# EAGLE design TremorMug_Final (EAGLE 9.6.2)
AUTHOR: LEWIS, YEE; BOARD_NAME: NUCLEO L476RG; DOC_NUM: 1; PROJECT_NAME: TREMOR MUG 1; REVISION: A
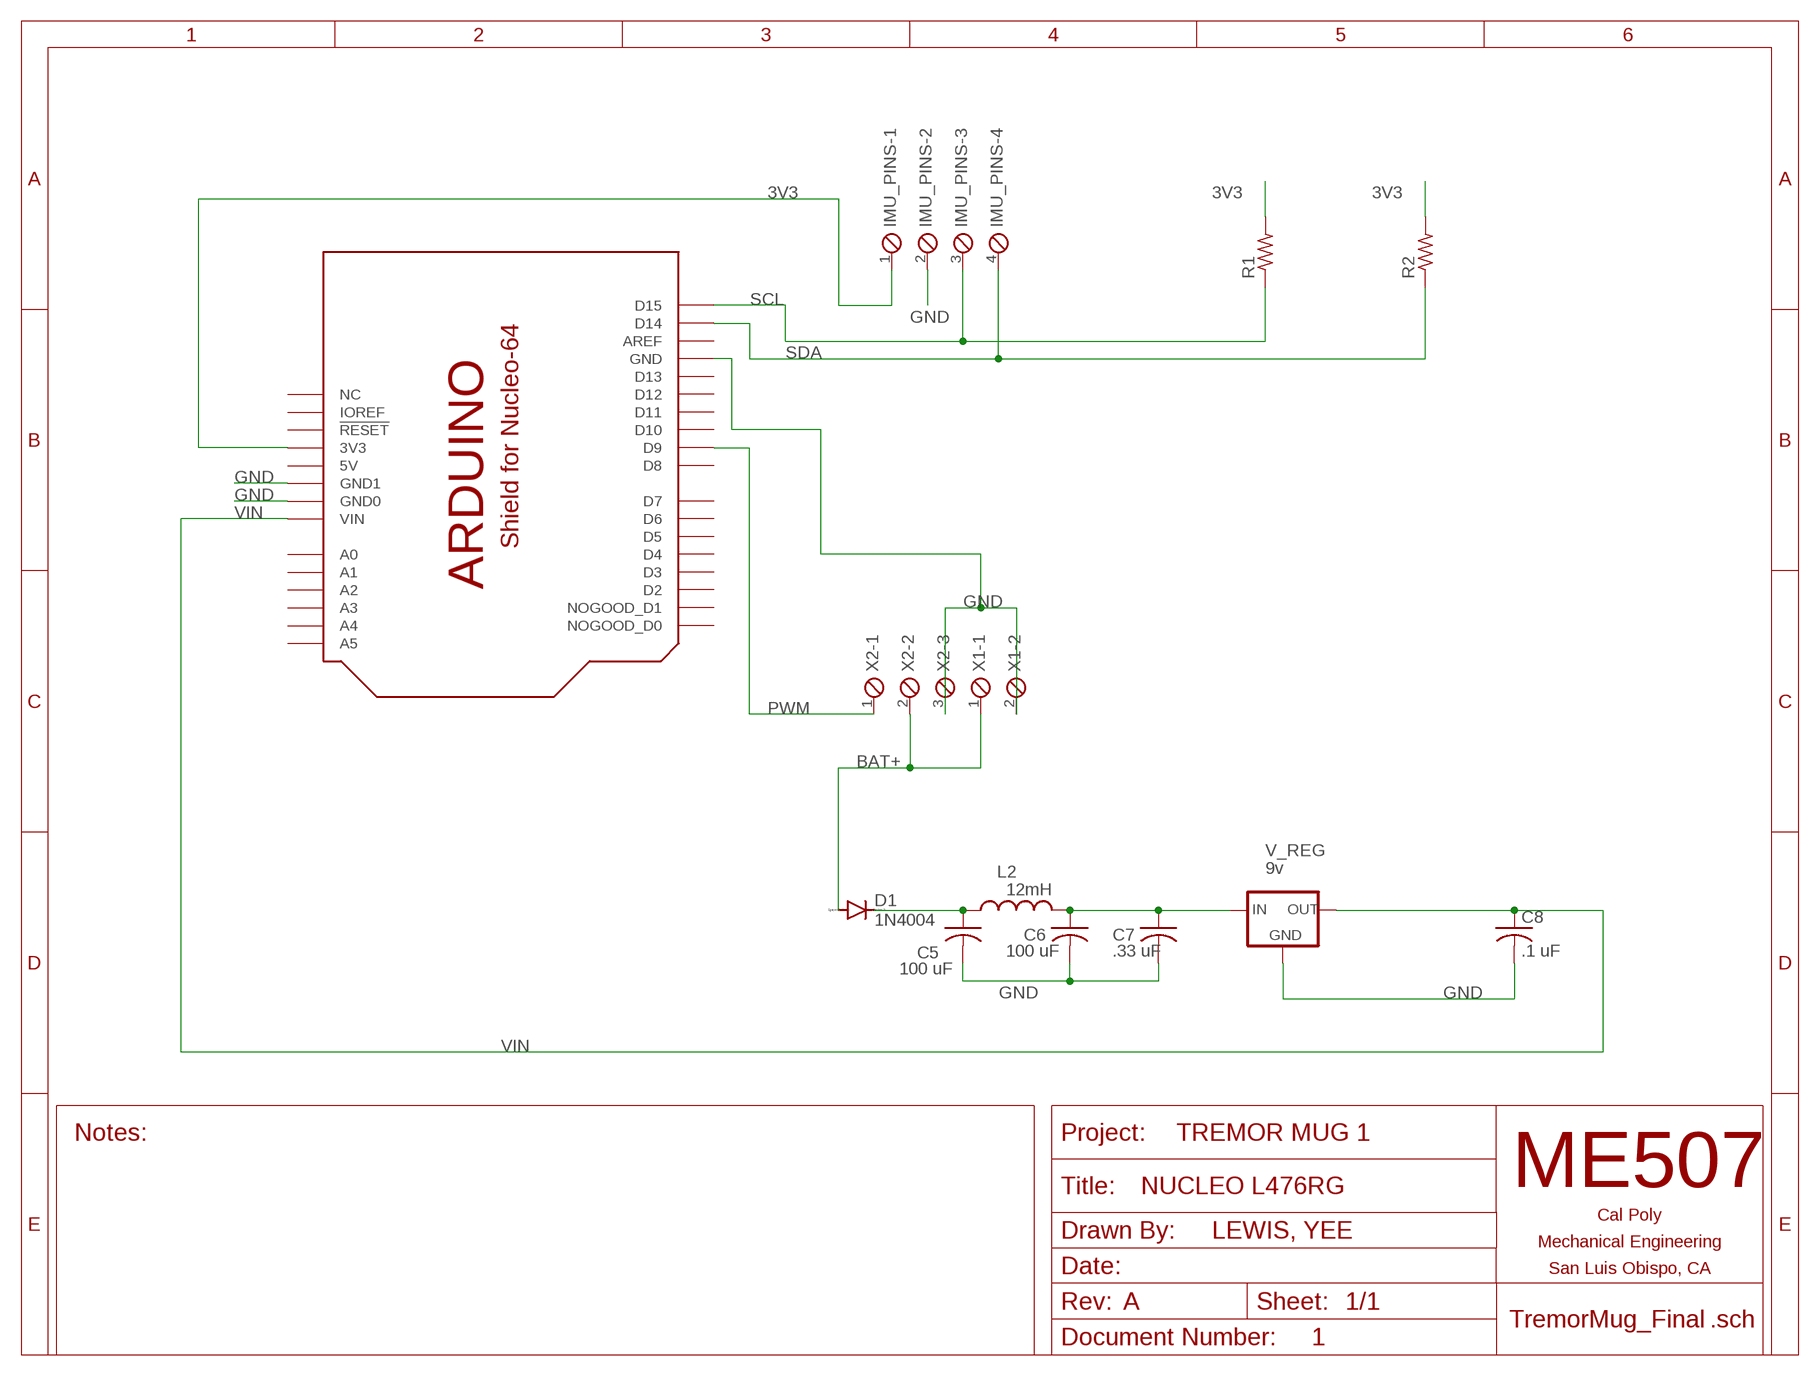
[diagram p0: schematic, sheet 1]

## Parts
C5  100 uF  C-US050-045X075  [C050-045X075]
C6  100 uF  C-US050-045X075  [C050-045X075]
C7  .33 uF  C-USC0805  [C0805]
C8  .1 uF  C-USC0805  [C0805]
D1  1N4004  [DO41-10]
IMU_PINS  SCREWTERM_4P_254  [4POL254]
L2  12mH  L-US0207/5V  [0207/5V]
R1  R-US_0204/7  [0204/7]
R2  R-US_0204/7  [0204/7]
U$1  SHIELD_FOR_NUCLE0_64_STANDARD  [SHIELD_FOR_NUCLEO_64_STD]
V_REG  9v  78MXXL  [78MXXL]
X1  SCREWTERM_2P_508  [2POL508]
X2  SCREWTERM_3P_381  [3POL381]

## Nets
3V3: IMU_PINS.1 R1.2 R2.2 U$1.3V(3V3)
BAT+: D1.A X1.1 X2.2
GND: C5.2 C6.2 C7.2 C8.2 IMU_PINS.2 U$1.GND U$1.GND1(GND0) U$1.GND2(GND1) V_REG.GND X1.2 X2.3
N$1: C6.1 C7.1 L2.2 V_REG.IN
N$3: C5.1 D1.C L2.1
PWM: U$1.D9 X2.1
SCL: IMU_PINS.3 R1.1 U$1.D15
SDA: IMU_PINS.4 R2.1 U$1.D14
VIN: C8.1 U$1.VIN V_REG.OUT
Unconnected: U$1.A0 U$1.A1 U$1.A2 U$1.A3 U$1.A4 U$1.A5 U$1.AREF U$1.D0(NOGOOD_D0) U$1.D1(NOGOOD_D1) U$1.D2 U$1.D3 U$1.D4 U$1.D5 U$1.D6 U$1.D7 U$1.D8 U$1.D10 U$1.D11 U$1.D12 U$1.D13 U$1.IOREF U$1.NC U$1.NRST(!RESET)

## Power pins joined to a net without a drawn wire
5V: U$1.5V

## Library data of the parts
C5-C8 = rcl:C-US: CAPACITOR, American symbol; SPICEPREFIX: C
D1 = diode:1N4004: DIODE general purpose rectifier, 1 A
IMU_PINS = ME507:SCREWTERM_4P: Screw Terminal Block This part is designed for a screw terminal connector. The 2.54mm (0.100 inch) foorprint can also be used for male or female pin headers such as those on most development boards. One can also solder wires directly into the holes, though this makes modifications or repairs to the system more inconvenient. Larger versions can carry more current.
L2 = rcl:L-US: INDUCTOR, American symbol; SPICEPREFIX: L
R1 R2 = rcl:R-US_: RESISTOR, American symbol; SPICEPREFIX: R
U$1 = ME507:SHIELD_FOR_NUCLE0_64: Arduino Style Shield for Nucleo-64 This is a board outline with pin locations for an Arduino style shield which fits on top of an STM32 Nucleo-64. Pin names are generic except for Nucleo specific pins such as IOREF. There are two board sizes, the standard which matches the size of an Arduino Uno, and the short version which can be less expensive to produce if you don't need a lot of board area. The outline is on the DIMENSION layer. When making a new board, you must delete the lines which form the default board outline so that this package's outlines control the dimensions of the board. Pins D0 and D1 are connected to a communications port and are not available for general use, so they are labeled as NOGOOD on the symbol and footprints.
V_REG = v-reg:78MXXL: VOLTAGE REGULATOR
X1 = ME507:SCREWTERM_2P: Screw Terminal Block This part is designed for a screw terminal connector. The 2.54mm (0.100 inch) foorprint can also be used for male or female pin headers such as those on most development boards. One can also solder wires directly into the holes, though this makes modifications or repairs to the system more inconvenient. Larger versions can carry more current.
X2 = ME507:SCREWTERM_3P: Screw Terminal Block This part is designed for a screw terminal connector. The 2.54mm (0.100 inch) foorprint can also be used for male or female pin headers such as those on most development boards. One can also solder wires directly into the holes, though this makes modifications or repairs to the system more inconvenient. Larger versions can carry more current.

## Board
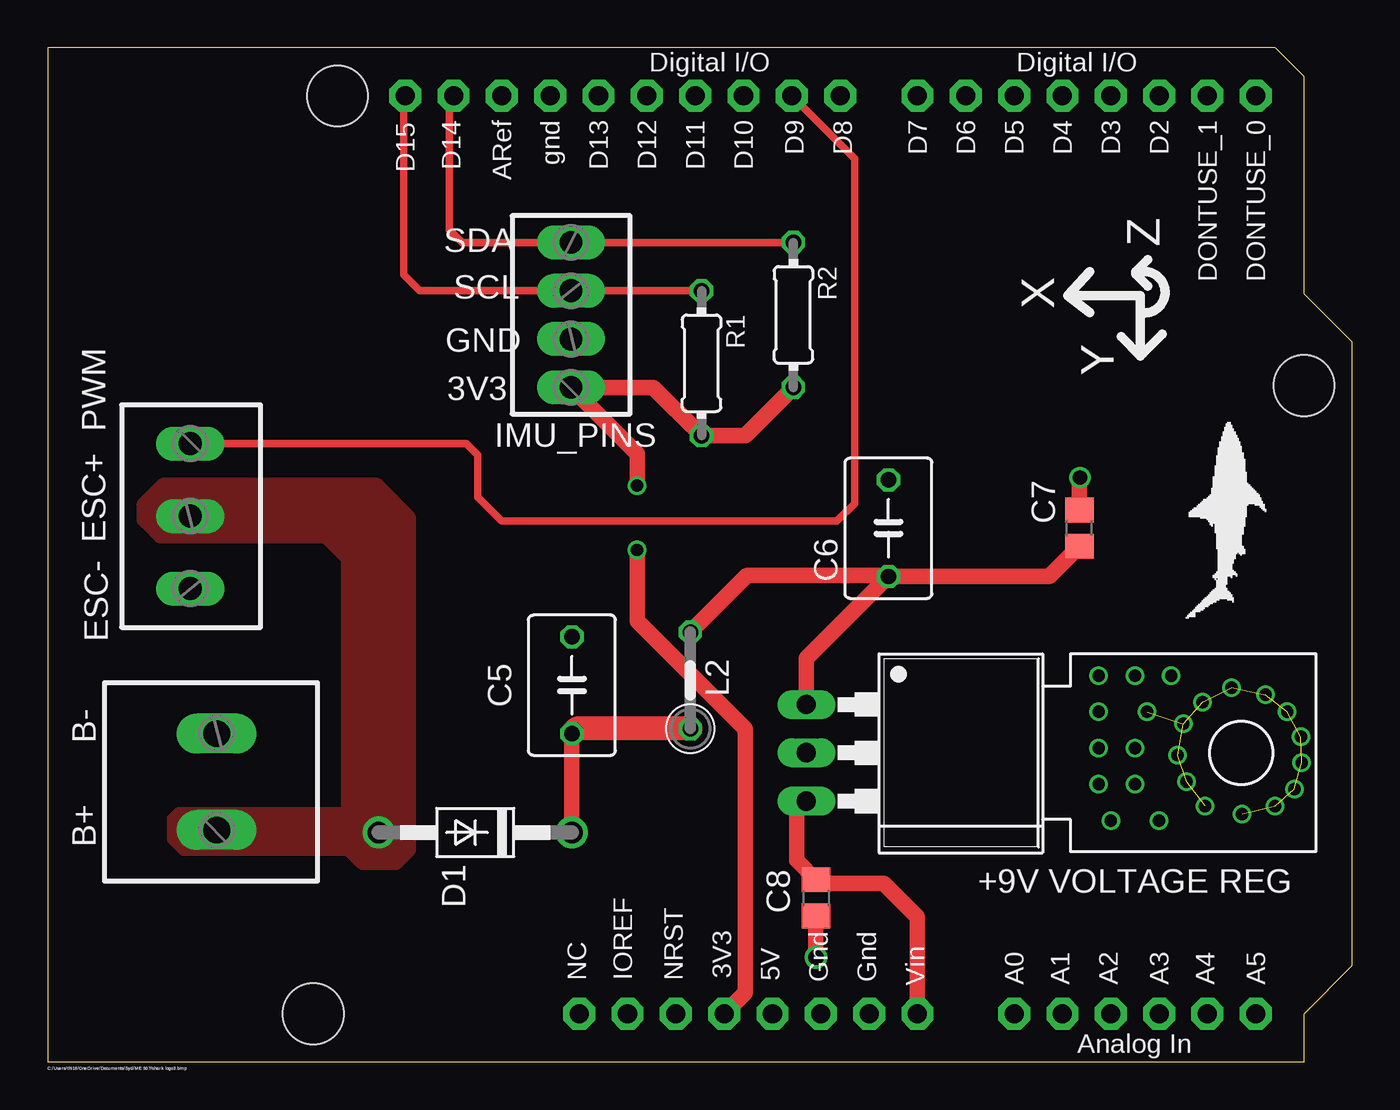
[diagram p1: board, top side]
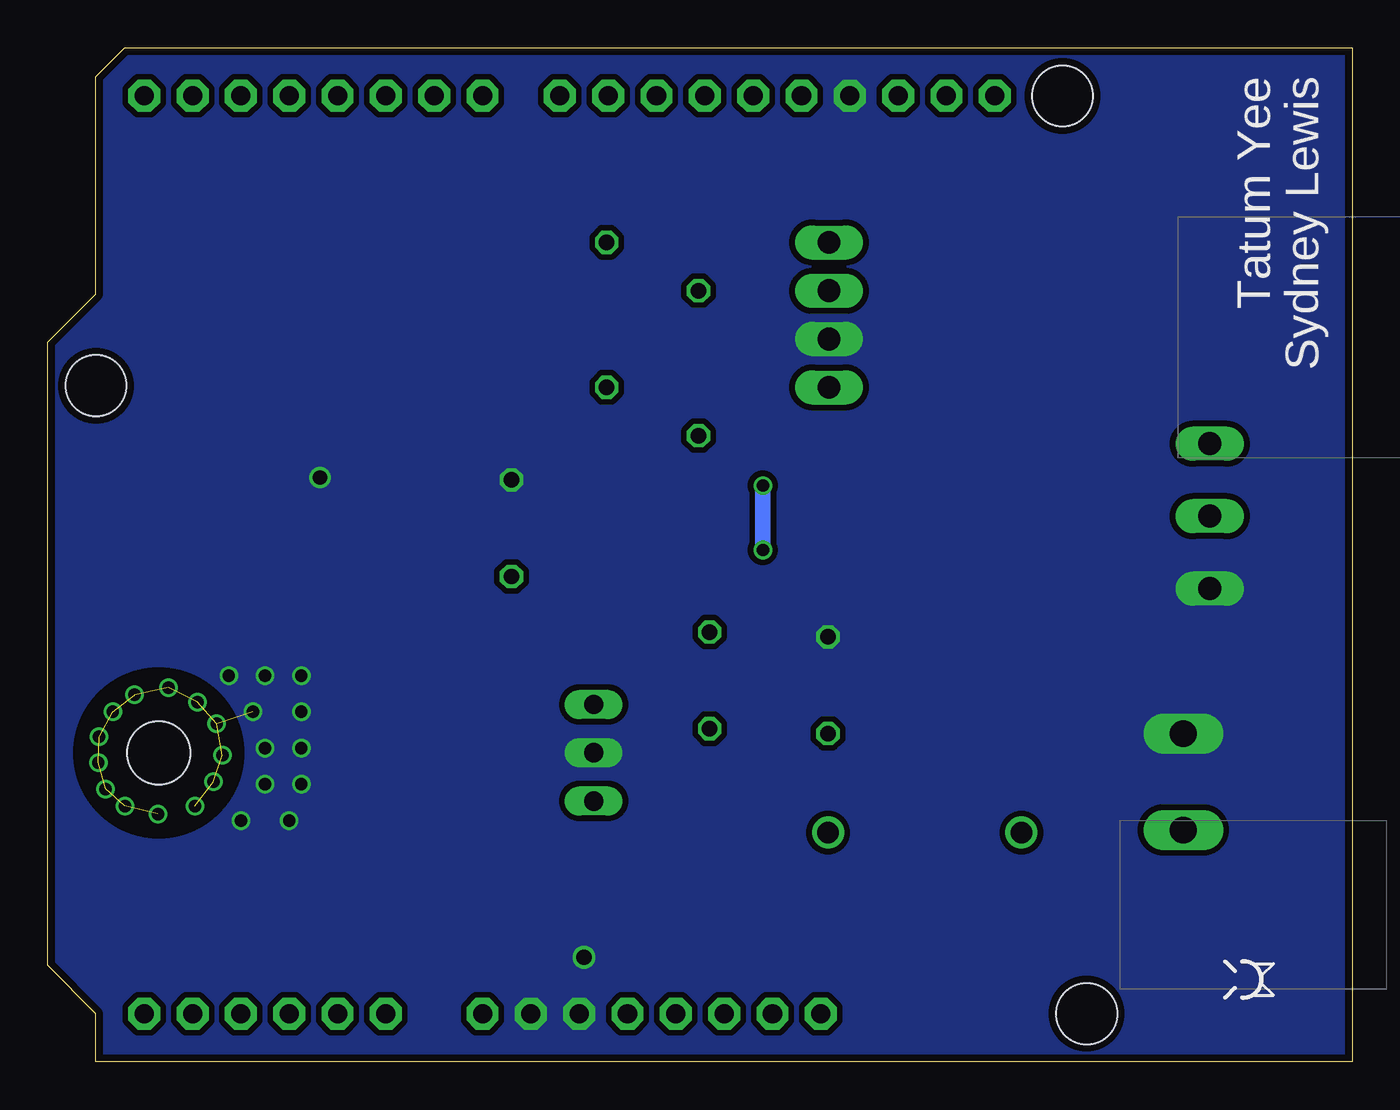
[diagram p2: board, bottom side, seen from below]

Size 68.58 x 53.34 mm. Coordinates in mm from the lower left corner, seen from the top.
Copper layers (1*16): Top 0.035559375mm / dielectric 1.6mm / Bottom 0.035559375mm
Design rules "oshpark-2layer": minimum track width 6mil, minimum drill 10mil, track to track 6mil, track to pad 6mil, pad to pad 6mil, via to via 6mil, smd to smd 6mil, copper to edge 15mil, drill to drill 6mil, minimum pad ring 5mil, minimum via ring 5mil, stop-mask expansion 2.5mil, vias tented up to drill 0mil, thermal gap 10mil

### Footprints (pad centres in the part's own frame; a part is rotated, then mirrored left to right if it is on the bottom)
C050-045X075 = drill 0.813 octagon: 1 -2.54,0; 2 2.54,0
C0805 = smd 1.3 x 1.5: 1 -0.95,0; 2 0.95,0
DO41-10 = drill 1.118: A 5.08,0; C -5.08,0
4POL254 = drill 1.2 long: 1 -3.81,0; 2 -1.27,0; 3 1.27,0; 4 3.81,0
0207/5V = drill 0.813 octagon: 1 -2.54,0; 2 2.54,0
0204/7 = drill 0.813 octagon: 1 -3.81,0; 2 3.81,0
SHIELD_FOR_NUCLEO_64_STD = drill 1 pad 1.676 octagon: 3V 35.56,2.54; 5V 38.1,2.54; A0 50.8,2.54; A1 53.34,2.54; A2 55.88,2.54; A3 58.42,2.54; A4 60.96,2.54; A5 63.5,2.54; AREF 23.876,50.8; D0 63.5,50.8; D1 60.96,50.8; D2 58.42,50.8; D3 55.88,50.8; D4 53.34,50.8; D5 50.8,50.8; D6 48.26,50.8; D7 45.72,50.8; D8 41.656,50.8; D9 39.116,50.8; D10 36.576,50.8; D11 34.036,50.8; D12 31.496,50.8; D13 28.956,50.8; D14 21.336,50.8; D15 18.796,50.8; GND 26.416,50.8; GND1 43.18,2.54; GND2 40.64,2.54; IOREF 30.48,2.54; NC 27.94,2.54; NRST 33.02,2.54; VIN 45.72,2.54 | hole 3.2: 15.24,50.8; 66.04,35.56; 13.97,2.54
78MXXL = drill 1.016 long: GND 0,-5.08; IN -2.54,-5.08; OUT 2.54,-5.08 | hole 3.302: 0,17.78
2POL508 = drill 1.4 long: 1 -2.54,0; 2 2.54,0
3POL381 = drill 1.2 long: 1 -3.81,0; 2 0,0; 3 3.81,0

### Placement (x,y rotation side)
C5  27.56,19.81 90 top
C6  44.2,28.07 90 top
C7  54.23,28.07 90 top
C8  40.39,8.64 270 top
D1  22.48,12.06 180 top
IMU_PINS  27.51,39.28 90 top
L2  33.78,20.07 90 top
R1  34.37,36.74 270 top
R2  39.2,39.28 270 top
U$1  0,0 0 top
V_REG  44.96,16.26 270 top
X1  8.89,14.73 90 top
X2  7.49,28.7 270 top

### Tracks (layer width: path | path; a pad name or v marks a point on that pad's centre or on a via)
3V3  (via drill 0.65)
  Top 0.813: v30.98,26.92 30.98,23.2 36.66,17.52 36.66,3.64 U$1.3V | v30.98,30.31 30.98,32 IMU_PINS.1 31.83,35.47 R1.2 36.66,32.93 R2.2
  Bottom 0.813: v30.98,30.31 v30.98,26.92
BAT+
  pour Top (no thermals): 18.85,11.05 7.11,11.05 6.48,11.68 6.48,12.83 6.86,13.21 18.21,13.21
  pour Top (no thermals): 6.35,30.31 17.27,30.31 18.96,28.61 18.96,11.17 18.29,10.5 16.59,10.5 15.83,11.26 15.83,26.5 14.65,27.68 5.93,27.68 5.33,28.28 5.08,28.53 5.08,29.29 6.1,30.31
GND  (via drill 0.65, 0.75, 0.8)  (13 unrouted)
  Top 0.813: v40.39,5.5 C8.2 | C7.2 54.23,30.69 v54.27,30.73
  other vias: 59.39,16.13 59.69,17.78 62.23,19.68 64.01,19.3 59.86,14.73 60.71,18.92 60.83,13.46 65.87,17.1 65.15,18.41 62.78,13.04 64.52,13.46 65.53,14.35 65.91,15.75 59.05,20.32 57.15,20.32 55.24,20.32 55.24,18.41 57.78,18.41 55.24,16.51 57.15,16.51 55.24,14.61 57.15,14.61 58.42,12.7 55.88,12.7
  pour Bottom (isolate 0.305, no thermals): 0,53.34 64.77,53.34 66.04,52.07 66.04,40.64 68.58,38.1 68.58,36.83 68.58,5.08 66.04,2.54 66.04,0 0,0
N$1
  Top 0.813: C6.1 44.15,25.57 36.74,25.57 L2.2 | C6.1 39.88,21.21 V_REG.IN | C6.1 52.64,25.53 C7.1
N$3
  Top 0.813: C5.1 D1.C
  Top 1.27: C5.1 27.81,17.53 L2.1
PWM
  Top 0.406: U$1.D9 42.41,47.5 42.41,29.38 41.48,28.45 23.87,28.45 22.6,29.71 22.6,31.92 22.01,32.51 X2.1
SCL
  Top 0.406: U$1.D15 18.71,50.72 18.71,41.4 19.56,40.55 IMU_PINS.3 R1.1
SDA
  Top 0.406: U$1.D14 21.12,50.59 21.12,43.77 21.8,43.09 IMU_PINS.4 | IMU_PINS.4 R2.1 | R2.1 | IMU_PINS.4
VIN
  Top 0.813: V_REG.OUT 39.37,13.21 39.37,10.6 C8.1 40.57,9.4 43.94,9.4 45.72,7.62 U$1.VIN

### Text on the board
tPlace: Z | SDA | X | SCL | Y | GND | 3V3 | C:/Users/tl918/OneDrive/Documents/Syd/ME 507/shark logo2.bmp | C:/Users/tl918/OneDrive/Documents/Syd/ME 507/shark logo3.bmp
bPlace: Sydney Lewis | Tatum Yee
tNames: PWM | ESC+ | ESC- | B- | B+ | +9V VOLTAGE REG